# EAGLE design token (EAGLE 8.4.0)
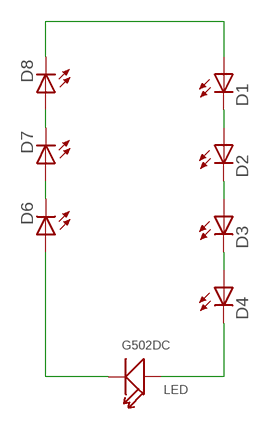
[diagram p0: schematic, sheet 1]

## Parts
D1  LEDSQR2X5  [LED2X5]
D2  LEDSQR2X5  [LED2X5]
D3  LEDSQR2X5  [LED2X5]
D4  LEDSQR2X5  [LED2X5]
D6  LEDSQR2X5  [LED2X5]
D7  LEDSQR2X5  [LED2X5]
D8  LEDSQR2X5  [LED2X5]
LED  G502DC  DIP-LED-GREEN-GREEN(2P-D5MM)  [LED2-2.54-D5.0MM]

## Nets
N$1: D1.A D8.K(C)
N$2: D1.K(C) D2.A
N$45: D2.K(C) D3.A
N$48: D3.K(C) D4.A
N$51: D4.K(C) LED.+
N$54: D6.A LED.-
N$59: D6.K(C) D7.A
N$65: D7.K(C) D8.A

## Library data of the parts
D1-D4 D6-D8 = adafruit:LED: LED OSRAM: - CHIPLED LG R971, LG N971, LY N971, LG Q971, LY Q971, LO R971, LY R971 LH N974, LH R974 LS Q976, LO Q976, LY Q976 LO Q996 - Hyper CHIPLED LW Q18S LB Q993, LB Q99A, LB R99A - SideLED LS A670, LO A670, LY A670, LG A670, LP A670 LB A673, LV A673, LT A673, LW A673 LH A674 LY A675 LS A676, LA A676, LO A676, LY A676, LW A676 LS A679, LY A679, LG A679 - Hyper Micro SIDELED® LS Y876, LA Y876, LO Y876, LY Y876 LT Y87S - SmartLED LW L88C, LW L88S LB L89C, LB L89S, LG L890 LS L89K, LO L89K, LY L89K LS L896, LA L896, LO L896, LY L896 - TOPLED LS T670, LO T670, LY T670, LG T670, LP T670 LSG T670, LSP T670, LSY T670, LOP T670, LYG T670 LG T671, LOG T671, LSG T671 LB T673, LV T673, LT T673, LW T673 LH T674 LS T676, LA T676, LO T676, LY T676, LB T676, LH T676, LSB T676, LW T676 LB T67C, LV T67C, LT T67C, LS T67K, LO T67K, LY T67K, LW E67C LS E67B, LA E67B, LO E67B, LY E67B, LB E67C, LV E67C, LT E67C LW T67C LS T679, LY T679, LG T679 LS T770, LO T770, LY T770, LG T770, LP T770 LB T773, LV T773, LT T773, LW T773 LH T774 LS E675, LA E675, LY E675, LS T675 LS T776, LA T776, LO T776, LY T776, LB T776 LHGB T686 LT T68C, LB T68C - Hyper Mini TOPLED® LB M676 - Mini TOPLED Santana® LG M470 LS M47K, LO M47K, LY M47K Source: http://www.osram.convergy.de/
LED = Seeed-OPL-Diode:DIP-LED-GREEN-GREEN(2P-D5MM): 304090038; MPN: G502DC

## Board
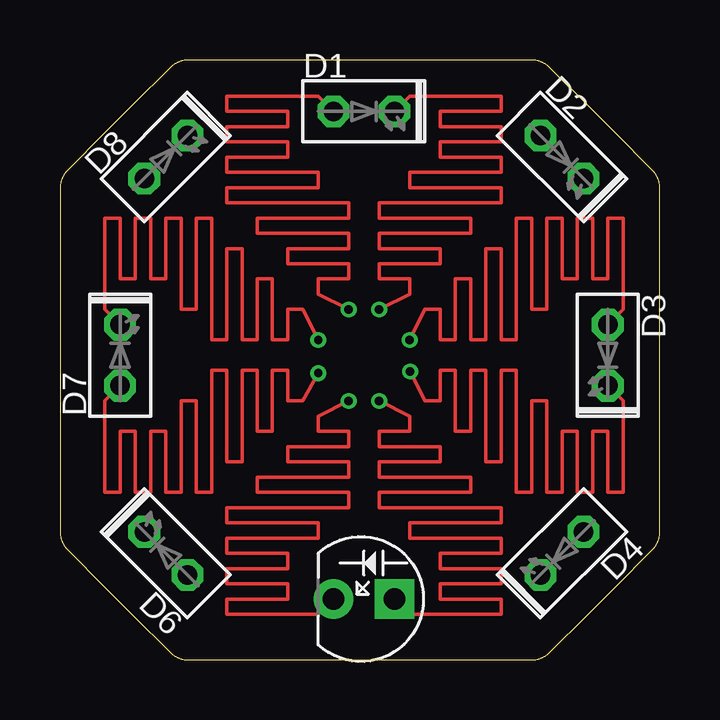
[diagram p1: board, top side]
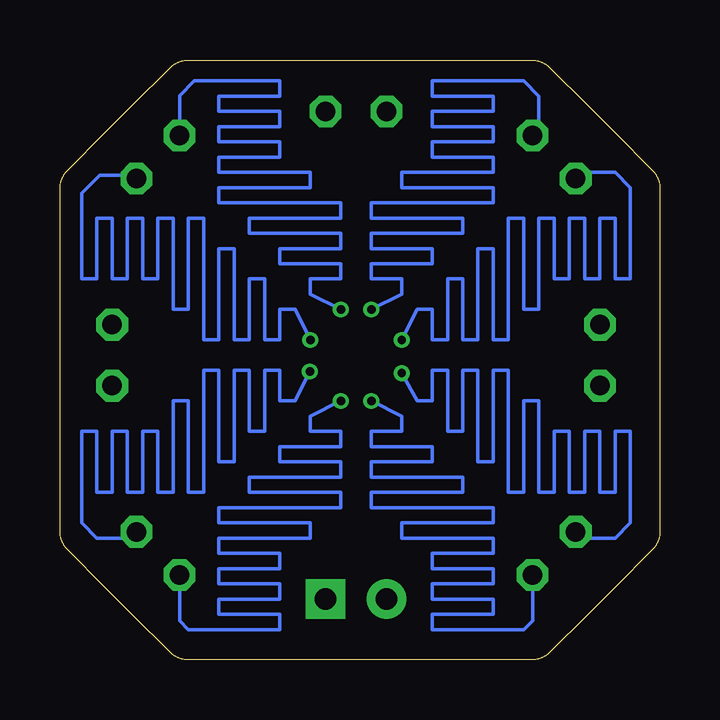
[diagram p2: board, bottom side, seen from below]

Size 25 x 25 mm. Coordinates in mm from the lower left corner, seen from the top.
Outline: 19.7,25 5.3,25 5.27,25 5.24,24.99 5.2,24.99 5.17,24.98 5.14,24.98 5.11,24.97 5.07,24.96 5.04,24.95 5.01,24.94 4.98,24.93 4.94,24.91 4.91,24.9 4.88,24.89 4.85,24.87 4.82,24.85 4.79,24.84 4.76,24.82 4.73,24.8 4.71,24.78 4.68,24.76 4.66,24.75 4.63,24.73 4.07,24.17 3.53,23.63 2.99,23.09 2.45,22.55 1.91,22.01 1.37,21.47 0.83,20.93 0.27,20.37 0.25,20.34 0.24,20.32 0.22,20.29 0.2,20.27 0.18,20.24 0.16,20.21 0.15,20.18 0.13,20.15 0.11,20.12 0.1,20.09 0.09,20.06 0.07,20.02 0.06,19.99 0.05,19.96 0.04,19.93 0.03,19.89 0.02,19.86 0.02,19.83 0.01,19.8 0.01,19.76 0,19.73 0,19.7 0,5.3 0,5.27 0.01,5.24 0.01,5.2 0.02,5.17 0.02,5.14 0.03,5.11 0.04,5.08 0.05,5.04 0.06,5.01 0.07,4.98 0.09,4.94 0.1,4.91 0.11,4.88 0.13,4.85 0.15,4.82 0.16,4.79 0.18,4.76 0.2,4.73 0.22,4.71 0.24,4.68 0.25,4.66 0.27,4.63 0.29,4.61 0.83,4.07 1.37,3.53 1.91,2.99 2.45,2.45 3.53,1.37 4.07,0.84 4.61,0.3 4.63,0.28 4.66,0.26 4.68,0.24 4.71,0.22 4.73,0.2 4.76,0.18 4.79,0.16 4.82,0.15 4.85,0.13 4.88,0.12 4.91,0.1 4.94,0.09 4.98,0.07 5.01,0.06 5.04,0.05 5.07,0.04 5.11,0.03 5.14,0.02 5.17,0.02 5.2,0.01 5.24,0.01 5.27,0 5.3,0 19.7,0 19.73,0 19.76,0.01 19.8,0.01 19.83,0.02 19.86,0.02 19.89,0.03 19.93,0.04 19.96,0.05 19.99,0.06 20.02,0.07 20.06,0.09 20.09,0.1 20.12,0.12 20.15,0.13 20.18,0.15 20.21,0.16 20.24,0.18 20.27,0.2 20.29,0.22 20.34,0.26 20.37,0.28 20.93,0.84 21.47,1.37 22.01,1.91 22.55,2.45 23.09,2.99 23.63,3.53 24.17,4.07 24.73,4.63 24.74,4.66 24.78,4.71 24.8,4.73 24.82,4.76 24.84,4.79 24.85,4.82 24.87,4.85 24.89,4.88 24.9,4.91 24.91,4.94 24.93,4.98 24.94,5.01 24.95,5.04 24.96,5.08 24.97,5.11 24.98,5.14 24.98,5.17 24.99,5.2 24.99,5.24 25,5.27 25,5.3 25,19.7 25,19.73 24.99,19.76 24.99,19.8 24.98,19.83 24.98,19.86 24.97,19.89 24.96,19.93 24.95,19.96 24.94,19.99 24.93,20.02 24.91,20.06 24.9,20.09 24.89,20.12 24.87,20.15 24.85,20.18 24.84,20.21 24.82,20.24 24.8,20.27 24.78,20.29 24.76,20.32 24.74,20.34 24.73,20.37 24.7,20.39 24.17,20.93 23.63,21.47 22.55,22.55 22.01,23.09 21.47,23.63 20.93,24.17 20.39,24.71 20.37,24.73 20.34,24.75 20.32,24.76 20.29,24.78 20.27,24.8 20.24,24.82 20.21,24.84 20.18,24.85 20.15,24.87 20.12,24.89 20.09,24.9 20.06,24.91 20.02,24.93 19.99,24.94 19.96,24.95 19.93,24.96 19.89,24.97 19.86,24.98 19.83,24.98 19.8,24.99 19.76,24.99 19.73,25 19.7,25
Copper layers (1*16): Top 0.035mm / dielectric 1.5mm / Bottom 0.035mm
Design rules "dirt_cheap_dirty_boards.v1": minimum track width 5mil, minimum drill 12mil, track to track 5mil, track to pad 5mil, pad to pad 5mil, via to via 5mil, smd to smd 0mil, copper to edge 10mil, drill to drill 10mil, minimum pad ring 10mil, minimum via ring 6mil, stop-mask expansion 2mil, vias tented up to drill 25mil, thermal gap 10mil

### Footprints (pad centres in the part's own frame; a part is rotated, then mirrored left to right if it is on the bottom)
LED2X5 = drill 0.813 octagon: A -1.27,0; K 1.27,0
LED2-2.54-D5.0MM = drill 0.889 pad 1.651 square: + -1.27,0 | drill 0.889 pad 1.651: - 1.27,0

### Placement (x,y rotation side)
D1  12.66,22.86 0 top
D2  20.92,20.96 315 top
D3  22.82,12.7 270 top
D4  20.92,4.45 225 top
D6  4.41,4.45 135 top
D7  2.5,12.7 90 top
D8  4.41,20.96 45 top
LED  12.66,2.54 180 top

### Tracks (layer width: path | path; a pad name or v marks a point on that pad's centre or on a via)
N$1  (via drill 0.35)
  Top 0.152: v12.03,14.61 10.76,15.24 10.76,15.88 12.03,15.88 12.03,16.51 9.49,16.51 9.49,17.15 12.03,17.15 12.03,17.78 8.22,17.78 8.22,18.42 12.03,18.42 12.03,19.05 6.95,19.05 6.95,19.69 10.76,19.69 10.76,20.32 6.95,20.32 6.95,20.96 9.49,20.96 9.49,21.59 6.95,21.59 6.95,22.23 9.49,22.23 9.49,22.86 6.95,22.86 6.95,23.5 10.76,23.5 D1.A
  Bottom 0.152: v12.03,14.61 10.76,15.24 10.76,15.88 12.03,15.88 12.03,16.51 9.49,16.51 9.49,17.15 12.03,17.15 12.03,17.78 8.22,17.78 8.22,18.42 12.03,18.42 12.03,19.05 6.95,19.05 6.95,19.69 10.76,19.69 10.76,20.32 6.95,20.32 6.95,20.96 9.49,20.96 9.49,21.59 6.95,21.59 6.95,22.23 9.49,22.23 9.49,22.86 6.95,22.86 6.95,23.5 9.49,23.5 9.49,24.13 5.68,24.13 5.04,23.5 5.04,22.12 D8.K
N$2  (via drill 0.35)
  Top 0.152: v13.3,14.61 14.57,15.24 14.57,15.88 13.3,15.88 13.3,16.51 15.84,16.51 15.84,17.15 13.3,17.15 13.3,17.78 17.11,17.78 17.11,18.42 13.3,18.42 13.3,19.05 18.38,19.05 18.38,19.69 14.57,19.69 14.57,20.32 18.38,20.32 18.38,20.96 15.84,20.96 15.84,21.59 18.38,21.59 18.38,22.23 15.84,22.23 15.84,22.86 18.38,22.86 18.38,23.5 14.57,23.5 D1.K
  Bottom 0.152: v13.3,14.61 14.57,15.24 14.57,15.88 13.3,15.88 13.3,16.51 15.84,16.51 15.84,17.15 13.3,17.15 13.3,17.78 17.11,17.78 17.11,18.42 13.3,18.42 13.3,19.05 18.38,19.05 18.38,19.69 14.57,19.69 14.57,20.32 18.38,20.32 18.38,20.96 15.84,20.96 15.84,21.59 18.38,21.59 18.38,22.23 15.84,22.23 15.84,22.86 18.38,22.86 18.38,23.5 15.84,23.5 15.84,24.13 | D2.A 20.02,23.52 19.41,24.13 15.84,24.13 | 15.84,24.13
N$45  (via drill 0.35)
  Top 0.152: v14.57,13.34 15.2,14.61 15.84,14.61 15.84,13.34 16.47,13.34 16.47,15.88 17.11,15.88 17.11,13.34 17.74,13.34 17.74,17.15 18.38,17.15 18.38,13.34 19.01,13.34 19.01,18.42 19.65,18.42 19.65,14.61 20.28,14.61 20.28,18.42 20.92,18.42 20.92,15.88 21.55,15.88 21.55,18.42 22.19,18.42 22.19,15.88 22.82,15.88 22.82,18.42 23.46,18.42 23.46,14.61 D3.A
  Bottom 0.152: v14.57,13.34 15.2,14.61 15.84,14.61 15.84,13.34 16.47,13.34 16.47,15.88 17.11,15.88 17.11,13.34 17.74,13.34 17.74,17.15 18.38,17.15 18.38,13.34 19.01,13.34 19.01,18.42 19.65,18.42 19.65,14.61 20.28,14.61 20.28,18.42 20.92,18.42 20.92,15.88 21.55,15.88 21.55,18.42 22.19,18.42 22.19,15.88 22.82,15.88 22.82,18.42 23.46,18.42 23.46,15.88 24.09,15.88 24.09,19.45 23.34,20.2 21.96,20.2 D2.K
N$48  (via drill 0.35)
  Top 0.152: v14.59,12.02 15.2,10.8 15.84,10.8 15.84,12.07 16.47,12.07 16.47,9.53 17.11,9.53 17.11,12.07 17.74,12.07 17.74,8.26 18.38,8.26 18.38,12.07 19.01,12.07 19.01,6.99 19.65,6.99 19.65,10.8 20.28,10.8 20.28,6.99 20.92,6.99 20.92,9.53 21.55,9.53 21.55,6.99 22.19,6.99 22.19,9.53 22.82,9.53 22.82,6.99 23.46,6.99 23.46,10.8 D3.K
  Bottom 0.152: D4.A 22.08,5.08 23.46,5.08 24.09,5.72 24.09,9.53 23.46,9.53 23.46,6.99 22.82,6.99 22.82,9.53 22.19,9.53 22.19,6.99 21.55,6.99 21.55,9.53 20.92,9.53 20.92,6.99 20.28,6.99 20.28,10.8 19.65,10.8 19.65,6.99 19.01,6.99 19.01,12.07 18.38,12.07 18.38,8.26 17.74,8.26 17.74,12.07 17.11,12.07 17.11,9.53 16.47,9.53 16.47,12.07 15.84,12.07 15.84,10.8 15.2,10.8 v14.59,12.02 14.59,12.04 14.57,12.07
N$51  (via drill 0.35)
  Top 0.152: v13.3,10.8 14.57,10.16 14.57,9.53 13.3,9.53 13.3,8.89 15.84,8.89 15.84,8.26 13.3,8.26 13.3,7.62 17.11,7.62 17.11,6.99 13.3,6.99 13.3,6.35 18.38,6.35 18.38,5.72 14.57,5.72 14.57,5.08 18.38,5.08 18.38,4.45 15.84,4.45 15.84,3.81 18.38,3.81 18.38,3.18 15.84,3.18 15.84,2.54 18.38,2.54 18.38,1.91 14.57,1.91 LED.+
  Bottom 0.152: D4.K 20.02,1.64 19.65,1.27 15.84,1.27 15.84,1.91 18.38,1.91 18.38,2.54 15.84,2.54 15.84,3.18 18.38,3.18 18.38,3.81 15.84,3.81 15.84,4.45 18.38,4.45 18.38,5.08 14.57,5.08 14.57,5.72 18.38,5.72 18.38,6.35 13.3,6.35 13.3,6.99 17.11,6.99 17.11,7.62 13.3,7.62 13.3,8.26 15.84,8.26 15.84,8.89 13.3,8.89 13.3,9.53 14.57,9.53 14.57,10.16 v13.3,10.8
N$54  (via drill 0.35)
  Top 0.152: LED.- 10.76,1.91 6.95,1.91 6.95,2.54 9.49,2.54 9.49,3.18 6.95,3.18 6.95,3.81 9.49,3.81 9.49,4.45 6.95,4.45 6.95,5.08 10.76,5.08 10.76,5.72 6.95,5.72 6.95,6.35 12.03,6.35 12.03,6.99 8.22,6.99 8.22,7.62 12.03,7.62 12.03,8.26 9.49,8.26 9.49,8.89 12.03,8.89 12.03,9.53 10.76,9.53 10.76,10.16 v12.03,10.8
  Bottom 0.152: v12.03,10.8 10.76,10.16 10.76,9.53 12.03,9.53 12.03,8.89 9.49,8.89 9.49,8.26 12.03,8.26 12.03,7.62 8.22,7.62 8.22,6.99 12.03,6.99 12.03,6.35 6.95,6.35 6.95,5.72 10.76,5.72 10.76,5.08 6.95,5.08 6.95,4.45 9.49,4.45 9.49,3.81 6.95,3.81 6.95,3.18 9.49,3.18 9.49,2.54 6.95,2.54 6.95,1.91 9.49,1.91 9.49,1.27 5.68,1.27 5.31,1.64 D6.A
N$59  (via drill 0.35)
  Top 0.152: v10.76,11.95 10.12,10.8 9.49,10.8 9.49,12.07 8.85,12.07 8.85,9.53 8.22,9.53 8.22,12.07 7.58,12.07 7.58,8.26 6.95,8.26 6.95,12.07 6.31,12.07 6.31,6.99 5.68,6.99 5.68,10.8 5.04,10.8 5.04,6.99 4.41,6.99 4.41,9.53 3.77,9.53 3.77,6.99 3.14,6.99 3.14,9.53 2.5,9.53 2.5,6.99 1.87,6.99 1.87,10.8 D7.A
  Bottom 0.152: D6.K 3.25,5.08 1.87,5.08 1.23,5.72 1.23,9.53 1.87,9.53 1.87,6.99 2.5,6.99 2.5,9.53 3.14,9.53 3.14,6.99 3.77,6.99 3.77,9.53 4.41,9.53 4.41,6.99 5.04,6.99 5.04,10.8 5.68,10.8 5.68,6.99 6.31,6.99 6.31,12.07 6.95,12.07 6.95,8.26 7.58,8.26 7.58,12.07 8.22,12.07 8.22,9.53 8.85,9.53 8.85,12.07 9.49,12.07 9.49,10.8 10.12,10.8 v10.76,11.95
N$65  (via drill 0.35)
  Top 0.152: v10.76,13.34 10.12,14.61 9.49,14.61 9.49,13.34 8.85,13.34 8.85,15.88 8.22,15.88 8.22,13.34 7.58,13.34 7.58,17.15 6.95,17.15 6.95,13.34 6.31,13.34 6.31,18.42 5.68,18.42 5.68,14.61 5.04,14.61 5.04,18.42 4.41,18.42 4.41,15.88 3.77,15.88 3.77,18.42 3.14,18.42 3.14,15.88 2.5,15.88 2.5,18.42 1.87,18.42 1.87,14.61 D7.K
  Bottom 0.152: v10.76,13.34 10.12,14.61 9.49,14.61 9.49,13.34 8.85,13.34 8.85,15.88 8.22,15.88 8.22,13.34 7.58,13.34 7.58,17.15 6.95,17.15 6.95,13.34 6.31,13.34 6.31,18.42 5.68,18.42 5.68,14.61 5.04,14.61 5.04,18.42 4.41,18.42 4.41,15.88 3.77,15.88 3.77,18.42 3.14,18.42 3.14,15.88 2.5,15.88 2.5,18.42 1.87,18.42 1.87,15.88 1.23,15.88 1.23,19.69 1.87,20.32 3.25,20.32 D8.A

### Text on the board
tSilk: BATT+ | LED